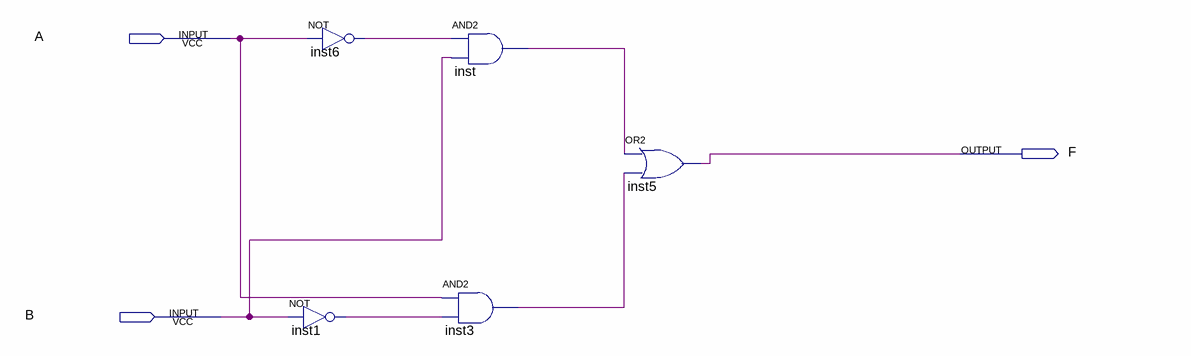
[diagram p0: schematic sheet]
// Quartus schematic lab3.bdf as structural Verilog: 5 symbols, 3 pins
module lab3 (
  input  A,
  input  B,
  output F
);

  wire inst1_out, inst3_out, inst6_out, inst_out;

  not inst1 (inst1_out, B);
  not inst6 (inst6_out, A);
  and inst (inst_out, inst6_out, B);
  and inst3 (inst3_out, A, inst1_out);
  or inst5 (F, inst_out, inst3_out);
endmodule
